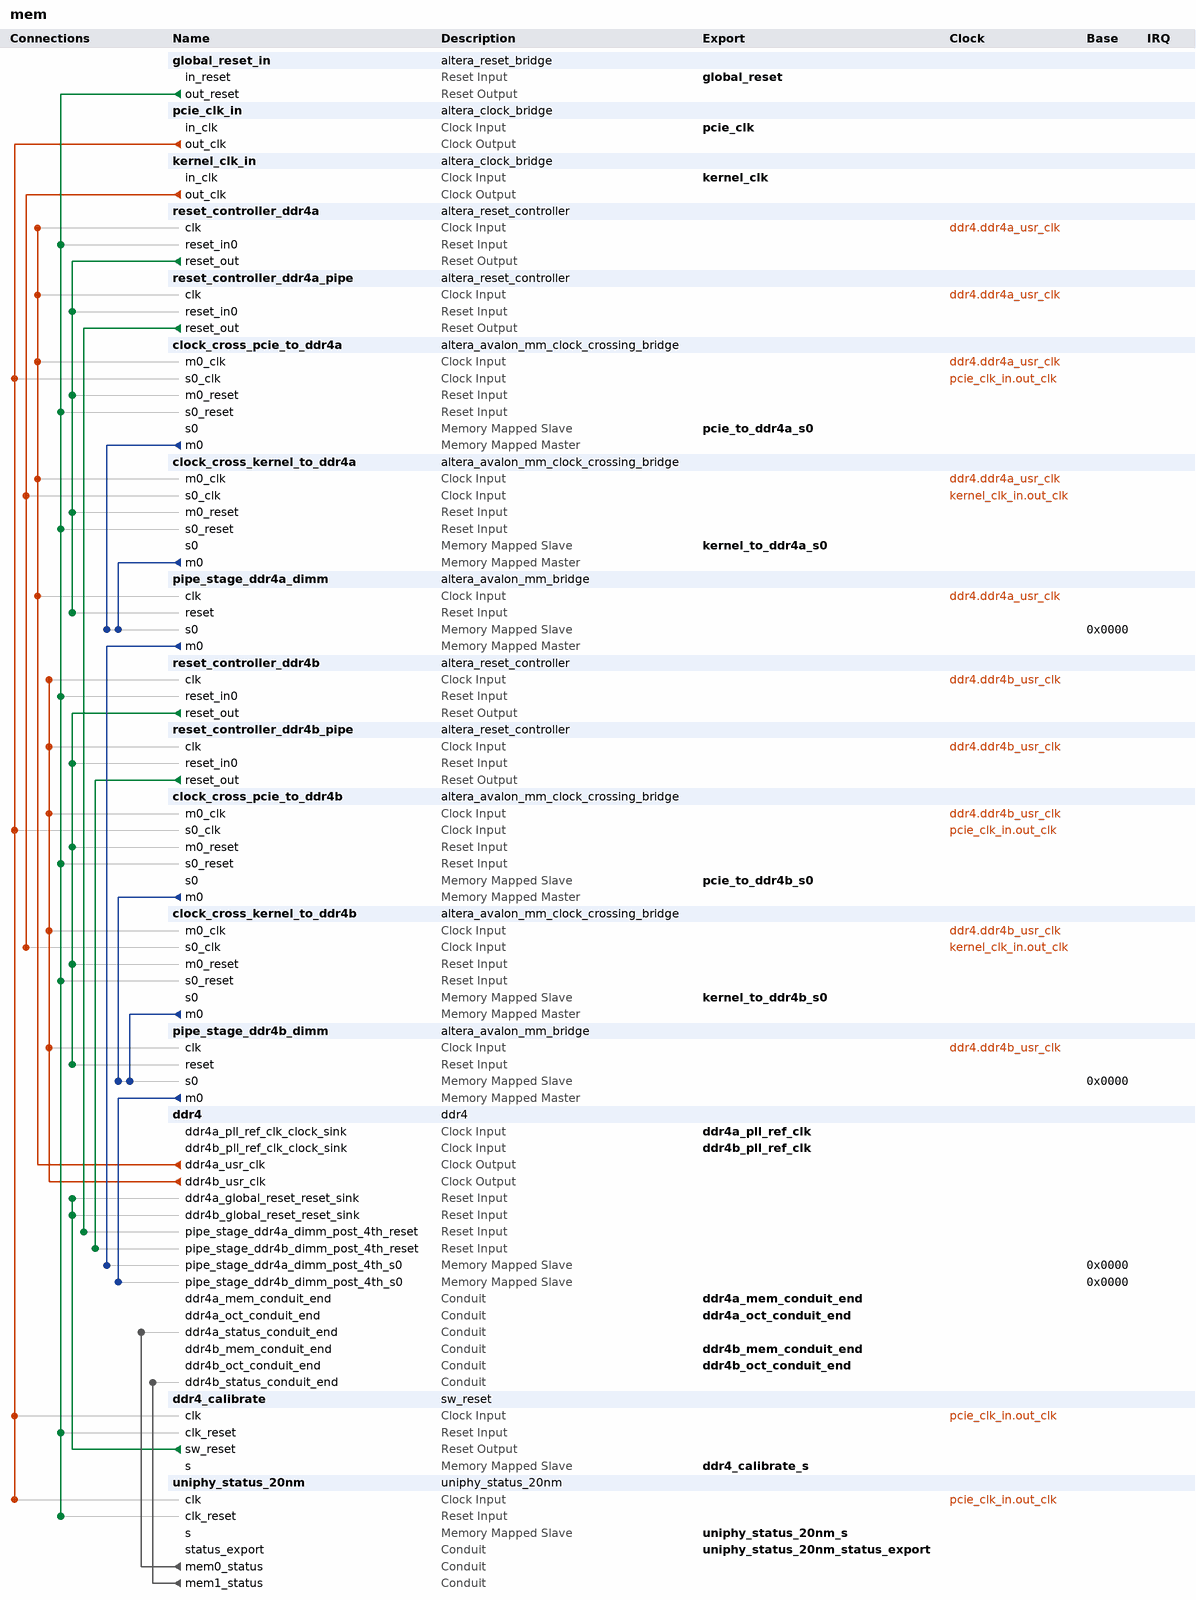
[diagram p0: system contents]
# Platform Designer (Qsys) system mem, Arria 10 10AXF40AA
# Parameters at their usual value, and those the tool derives, are not listed.
package require -exact qsys 1.0
create_system mem
set_project_property DEVICE_FAMILY {Arria 10}
set_project_property DEVICE 10AXF40AA

add_component global_reset_in ip/mem/mem_global_reset_in.ip altera_reset_bridge global_reset_in 18.1
load_component global_reset_in
set_component_parameter_value ACTIVE_LOW_RESET 0
set_component_parameter_value SYNCHRONOUS_EDGES none
set_component_parameter_value SYNC_RESET 0
save_component

add_component pcie_clk_in ip/mem/mem_pcie_clk_in.ip altera_clock_bridge pcie_clk_in 18.1
load_component pcie_clk_in
set_component_parameter_value DERIVED_CLOCK_RATE 125000000
set_component_parameter_value EXPLICIT_CLOCK_RATE 0
save_component

add_component kernel_clk_in ip/mem/mem_kernel_clk_in.ip altera_clock_bridge kernel_clk_in 18.1
load_component kernel_clk_in
set_component_parameter_value DERIVED_CLOCK_RATE 400000000
set_component_parameter_value EXPLICIT_CLOCK_RATE 0
save_component

add_component reset_controller_ddr4a ip/mem/mem_reset_controller_ddr4a.ip altera_reset_controller reset_controller_ddr4a 18.1
load_component reset_controller_ddr4a
set_component_parameter_value NUM_RESET_INPUTS 1
set_component_parameter_value SYNC_DEPTH 2
set_component_parameter_value ADAPT_RESET_REQUEST 0
save_component

add_component reset_controller_ddr4a_pipe ip/mem/mem_reset_controller_ddr4a_pipe.ip altera_reset_controller reset_controller_ddr4a_pipe 18.1
load_component reset_controller_ddr4a_pipe
set_component_parameter_value NUM_RESET_INPUTS 1
set_component_parameter_value SYNC_DEPTH 2
set_component_parameter_value ADAPT_RESET_REQUEST 0
save_component

add_component clock_cross_pcie_to_ddr4a ip/mem/mem_clock_cross_pcie_to_ddr4a.ip altera_avalon_mm_clock_crossing_bridge clock_cross_pcie_to_ddr4a 18.1
load_component clock_cross_pcie_to_ddr4a
set_component_parameter_value DATA_WIDTH 512
set_component_parameter_value ADDRESS_WIDTH 31
set_component_parameter_value USE_AUTO_ADDRESS_WIDTH 1
set_component_parameter_value MAX_BURST_SIZE 16
set_component_parameter_value COMMAND_FIFO_DEPTH 32
set_component_parameter_value RESPONSE_FIFO_DEPTH 512
set_component_parameter_value MASTER_SYNC_DEPTH 2
set_component_parameter_value SLAVE_SYNC_DEPTH 2
set_component_parameter_value SYNC_RESET 0
save_component

add_component clock_cross_kernel_to_ddr4a ip/mem/mem_clock_cross_kernel_to_ddr4a.ip altera_avalon_mm_clock_crossing_bridge clock_cross_kernel_to_ddr4a 18.1
load_component clock_cross_kernel_to_ddr4a
set_component_parameter_value DATA_WIDTH 512
set_component_parameter_value ADDRESS_WIDTH 31
set_component_parameter_value USE_AUTO_ADDRESS_WIDTH 1
set_component_parameter_value MAX_BURST_SIZE 16
set_component_parameter_value COMMAND_FIFO_DEPTH 32
set_component_parameter_value RESPONSE_FIFO_DEPTH 512
set_component_parameter_value MASTER_SYNC_DEPTH 2
set_component_parameter_value SLAVE_SYNC_DEPTH 2
set_component_parameter_value SYNC_RESET 0
save_component

add_component pipe_stage_ddr4a_dimm ip/mem/mem_pipe_stage_ddr4a_dimm.ip altera_avalon_mm_bridge pipe_stage_ddr4a_dimm 18.1
load_component pipe_stage_ddr4a_dimm
set_component_parameter_value DATA_WIDTH 512
set_component_parameter_value ADDRESS_WIDTH 31
set_component_parameter_value USE_AUTO_ADDRESS_WIDTH 1
set_component_parameter_value ADDRESS_UNITS SYMBOLS
set_component_parameter_value MAX_BURST_SIZE 16
set_component_parameter_value MAX_PENDING_RESPONSES 32
set_component_parameter_value SYNC_RESET 0
save_component

add_component reset_controller_ddr4b ip/mem/mem_reset_controller_ddr4b.ip altera_reset_controller reset_controller_ddr4b 18.1
load_component reset_controller_ddr4b
set_component_parameter_value NUM_RESET_INPUTS 1
set_component_parameter_value SYNC_DEPTH 2
set_component_parameter_value ADAPT_RESET_REQUEST 0
save_component

add_component reset_controller_ddr4b_pipe ip/mem/mem_reset_controller_ddr4b_pipe.ip altera_reset_controller reset_controller_ddr4b_pipe 18.1
load_component reset_controller_ddr4b_pipe
set_component_parameter_value NUM_RESET_INPUTS 1
set_component_parameter_value SYNC_DEPTH 2
set_component_parameter_value ADAPT_RESET_REQUEST 0
save_component

add_component clock_cross_pcie_to_ddr4b ip/mem/mem_clock_cross_pcie_to_ddr4b.ip altera_avalon_mm_clock_crossing_bridge clock_cross_pcie_to_ddr4b 18.1
load_component clock_cross_pcie_to_ddr4b
set_component_parameter_value DATA_WIDTH 512
set_component_parameter_value ADDRESS_WIDTH 31
set_component_parameter_value USE_AUTO_ADDRESS_WIDTH 1
set_component_parameter_value MAX_BURST_SIZE 16
set_component_parameter_value COMMAND_FIFO_DEPTH 32
set_component_parameter_value RESPONSE_FIFO_DEPTH 512
set_component_parameter_value MASTER_SYNC_DEPTH 2
set_component_parameter_value SLAVE_SYNC_DEPTH 2
set_component_parameter_value SYNC_RESET 0
save_component

add_component clock_cross_kernel_to_ddr4b ip/mem/mem_clock_cross_kernel_to_ddr4b.ip altera_avalon_mm_clock_crossing_bridge clock_cross_kernel_to_ddr4b 18.1
load_component clock_cross_kernel_to_ddr4b
set_component_parameter_value DATA_WIDTH 512
set_component_parameter_value ADDRESS_WIDTH 31
set_component_parameter_value USE_AUTO_ADDRESS_WIDTH 1
set_component_parameter_value MAX_BURST_SIZE 16
set_component_parameter_value COMMAND_FIFO_DEPTH 32
set_component_parameter_value RESPONSE_FIFO_DEPTH 512
set_component_parameter_value MASTER_SYNC_DEPTH 2
set_component_parameter_value SLAVE_SYNC_DEPTH 2
set_component_parameter_value SYNC_RESET 0
save_component

add_component pipe_stage_ddr4b_dimm ip/mem/mem_pipe_stage_ddr4b_dimm.ip altera_avalon_mm_bridge pipe_stage_ddr4b_dimm 18.1
load_component pipe_stage_ddr4b_dimm
set_component_parameter_value DATA_WIDTH 512
set_component_parameter_value ADDRESS_WIDTH 31
set_component_parameter_value USE_AUTO_ADDRESS_WIDTH 1
set_component_parameter_value ADDRESS_UNITS SYMBOLS
set_component_parameter_value MAX_BURST_SIZE 16
set_component_parameter_value MAX_PENDING_RESPONSES 32
set_component_parameter_value SYNC_RESET 0
save_component

add_component ddr4 ddr4.qsys ddr4 ddr4 

add_component ddr4_calibrate ip/mem/mem_ddr4_calibrate.ip sw_reset ddr4_calibrate 10.0
load_component ddr4_calibrate
set_component_parameter_value WIDTH 32
set_component_parameter_value LOG2_RESET_CYCLES 3
set_component_parameter_value WIDTH_BYTES 4
save_component

add_component uniphy_status_20nm ip/mem/mem_uniphy_status_20nm.ip uniphy_status_20nm uniphy_status_20nm 14.1
load_component uniphy_status_20nm
set_component_parameter_value WIDTH 32
set_component_parameter_value NUM_UNIPHYS 2
save_component

# connections
add_connection ddr4.ddr4a_usr_clk clock_cross_kernel_to_ddr4a.m0_clk clock
add_connection ddr4.ddr4a_usr_clk clock_cross_pcie_to_ddr4a.m0_clk clock
add_connection ddr4.ddr4a_usr_clk pipe_stage_ddr4a_dimm.clk clock
add_connection ddr4.ddr4a_usr_clk reset_controller_ddr4a.clk clock
add_connection ddr4.ddr4a_usr_clk reset_controller_ddr4a_pipe.clk clock
add_connection ddr4.ddr4b_usr_clk clock_cross_kernel_to_ddr4b.m0_clk clock
add_connection ddr4.ddr4b_usr_clk clock_cross_pcie_to_ddr4b.m0_clk clock
add_connection ddr4.ddr4b_usr_clk pipe_stage_ddr4b_dimm.clk clock
add_connection ddr4.ddr4b_usr_clk reset_controller_ddr4b.clk clock
add_connection ddr4.ddr4b_usr_clk reset_controller_ddr4b_pipe.clk clock
add_connection kernel_clk_in.out_clk clock_cross_kernel_to_ddr4a.s0_clk clock
add_connection kernel_clk_in.out_clk clock_cross_kernel_to_ddr4b.s0_clk clock
add_connection pcie_clk_in.out_clk clock_cross_pcie_to_ddr4a.s0_clk clock
add_connection pcie_clk_in.out_clk clock_cross_pcie_to_ddr4b.s0_clk clock
add_connection pcie_clk_in.out_clk ddr4_calibrate.clk clock
add_connection pcie_clk_in.out_clk uniphy_status_20nm.clk clock
add_connection ddr4_calibrate.sw_reset ddr4.ddr4a_global_reset_reset_sink reset
add_connection ddr4_calibrate.sw_reset ddr4.ddr4b_global_reset_reset_sink reset
add_connection global_reset_in.out_reset clock_cross_kernel_to_ddr4a.s0_reset reset
add_connection global_reset_in.out_reset clock_cross_kernel_to_ddr4b.s0_reset reset
add_connection global_reset_in.out_reset clock_cross_pcie_to_ddr4a.s0_reset reset
add_connection global_reset_in.out_reset clock_cross_pcie_to_ddr4b.s0_reset reset
add_connection global_reset_in.out_reset ddr4_calibrate.clk_reset reset
add_connection global_reset_in.out_reset reset_controller_ddr4a.reset_in0 reset
add_connection global_reset_in.out_reset reset_controller_ddr4b.reset_in0 reset
add_connection global_reset_in.out_reset uniphy_status_20nm.clk_reset reset
add_connection reset_controller_ddr4a.reset_out clock_cross_kernel_to_ddr4a.m0_reset reset
add_connection reset_controller_ddr4a.reset_out clock_cross_pcie_to_ddr4a.m0_reset reset
add_connection reset_controller_ddr4a.reset_out pipe_stage_ddr4a_dimm.reset reset
add_connection reset_controller_ddr4a.reset_out reset_controller_ddr4a_pipe.reset_in0 reset
add_connection reset_controller_ddr4a_pipe.reset_out ddr4.pipe_stage_ddr4a_dimm_post_4th_reset reset
add_connection reset_controller_ddr4b.reset_out clock_cross_kernel_to_ddr4b.m0_reset reset
add_connection reset_controller_ddr4b.reset_out clock_cross_pcie_to_ddr4b.m0_reset reset
add_connection reset_controller_ddr4b.reset_out pipe_stage_ddr4b_dimm.reset reset
add_connection reset_controller_ddr4b.reset_out reset_controller_ddr4b_pipe.reset_in0 reset
add_connection reset_controller_ddr4b_pipe.reset_out ddr4.pipe_stage_ddr4b_dimm_post_4th_reset reset
add_connection clock_cross_kernel_to_ddr4a.m0 pipe_stage_ddr4a_dimm.s0 avalon
set_connection_parameter_value clock_cross_kernel_to_ddr4a.m0/pipe_stage_ddr4a_dimm.s0 baseAddress 0x0000
add_connection clock_cross_kernel_to_ddr4b.m0 pipe_stage_ddr4b_dimm.s0 avalon
set_connection_parameter_value clock_cross_kernel_to_ddr4b.m0/pipe_stage_ddr4b_dimm.s0 baseAddress 0x0000
add_connection clock_cross_pcie_to_ddr4a.m0 pipe_stage_ddr4a_dimm.s0 avalon
set_connection_parameter_value clock_cross_pcie_to_ddr4a.m0/pipe_stage_ddr4a_dimm.s0 baseAddress 0x0000
add_connection clock_cross_pcie_to_ddr4b.m0 pipe_stage_ddr4b_dimm.s0 avalon
set_connection_parameter_value clock_cross_pcie_to_ddr4b.m0/pipe_stage_ddr4b_dimm.s0 baseAddress 0x0000
add_connection pipe_stage_ddr4a_dimm.m0 ddr4.pipe_stage_ddr4a_dimm_post_4th_s0 avalon
set_connection_parameter_value pipe_stage_ddr4a_dimm.m0/ddr4.pipe_stage_ddr4a_dimm_post_4th_s0 baseAddress 0x0000
add_connection pipe_stage_ddr4b_dimm.m0 ddr4.pipe_stage_ddr4b_dimm_post_4th_s0 avalon
set_connection_parameter_value pipe_stage_ddr4b_dimm.m0/ddr4.pipe_stage_ddr4b_dimm_post_4th_s0 baseAddress 0x0000
add_connection uniphy_status_20nm.mem0_status ddr4.ddr4a_status_conduit_end conduit
add_connection uniphy_status_20nm.mem1_status ddr4.ddr4b_status_conduit_end conduit

# exported interfaces
add_interface ddr4_calibrate_s avalon slave
set_interface_property ddr4_calibrate_s EXPORT_OF ddr4_calibrate.s
add_interface ddr4a_mem_conduit_end conduit end
set_interface_property ddr4a_mem_conduit_end EXPORT_OF ddr4.ddr4a_mem_conduit_end
add_interface ddr4a_oct_conduit_end conduit end
set_interface_property ddr4a_oct_conduit_end EXPORT_OF ddr4.ddr4a_oct_conduit_end
add_interface ddr4a_pll_ref_clk clock sink
set_interface_property ddr4a_pll_ref_clk EXPORT_OF ddr4.ddr4a_pll_ref_clk_clock_sink
add_interface ddr4b_mem_conduit_end conduit end
set_interface_property ddr4b_mem_conduit_end EXPORT_OF ddr4.ddr4b_mem_conduit_end
add_interface ddr4b_oct_conduit_end conduit end
set_interface_property ddr4b_oct_conduit_end EXPORT_OF ddr4.ddr4b_oct_conduit_end
add_interface ddr4b_pll_ref_clk clock sink
set_interface_property ddr4b_pll_ref_clk EXPORT_OF ddr4.ddr4b_pll_ref_clk_clock_sink
add_interface global_reset reset sink
set_interface_property global_reset EXPORT_OF global_reset_in.in_reset
add_interface kernel_clk clock sink
set_interface_property kernel_clk EXPORT_OF kernel_clk_in.in_clk
add_interface kernel_to_ddr4a_s0 avalon slave
set_interface_property kernel_to_ddr4a_s0 EXPORT_OF clock_cross_kernel_to_ddr4a.s0
add_interface kernel_to_ddr4b_s0 avalon slave
set_interface_property kernel_to_ddr4b_s0 EXPORT_OF clock_cross_kernel_to_ddr4b.s0
add_interface pcie_clk clock sink
set_interface_property pcie_clk EXPORT_OF pcie_clk_in.in_clk
add_interface pcie_to_ddr4a_s0 avalon slave
set_interface_property pcie_to_ddr4a_s0 EXPORT_OF clock_cross_pcie_to_ddr4a.s0
add_interface pcie_to_ddr4b_s0 avalon slave
set_interface_property pcie_to_ddr4b_s0 EXPORT_OF clock_cross_pcie_to_ddr4b.s0
add_interface uniphy_status_20nm_s avalon slave
set_interface_property uniphy_status_20nm_s EXPORT_OF uniphy_status_20nm.s
add_interface uniphy_status_20nm_status_export conduit end
set_interface_property uniphy_status_20nm_status_export EXPORT_OF uniphy_status_20nm.status_export

set_interconnect_requirement {$system} qsys_mm.clockCrossingAdapter HANDSHAKE
set_interconnect_requirement {$system} qsys_mm.enableEccProtection FALSE
set_interconnect_requirement {$system} qsys_mm.insertDefaultSlave FALSE
set_interconnect_requirement {$system} qsys_mm.maxAdditionalLatency 1

save_system mem.qsys
